# EAGLE design LightSwitch4 (EAGLE 9.2.1)
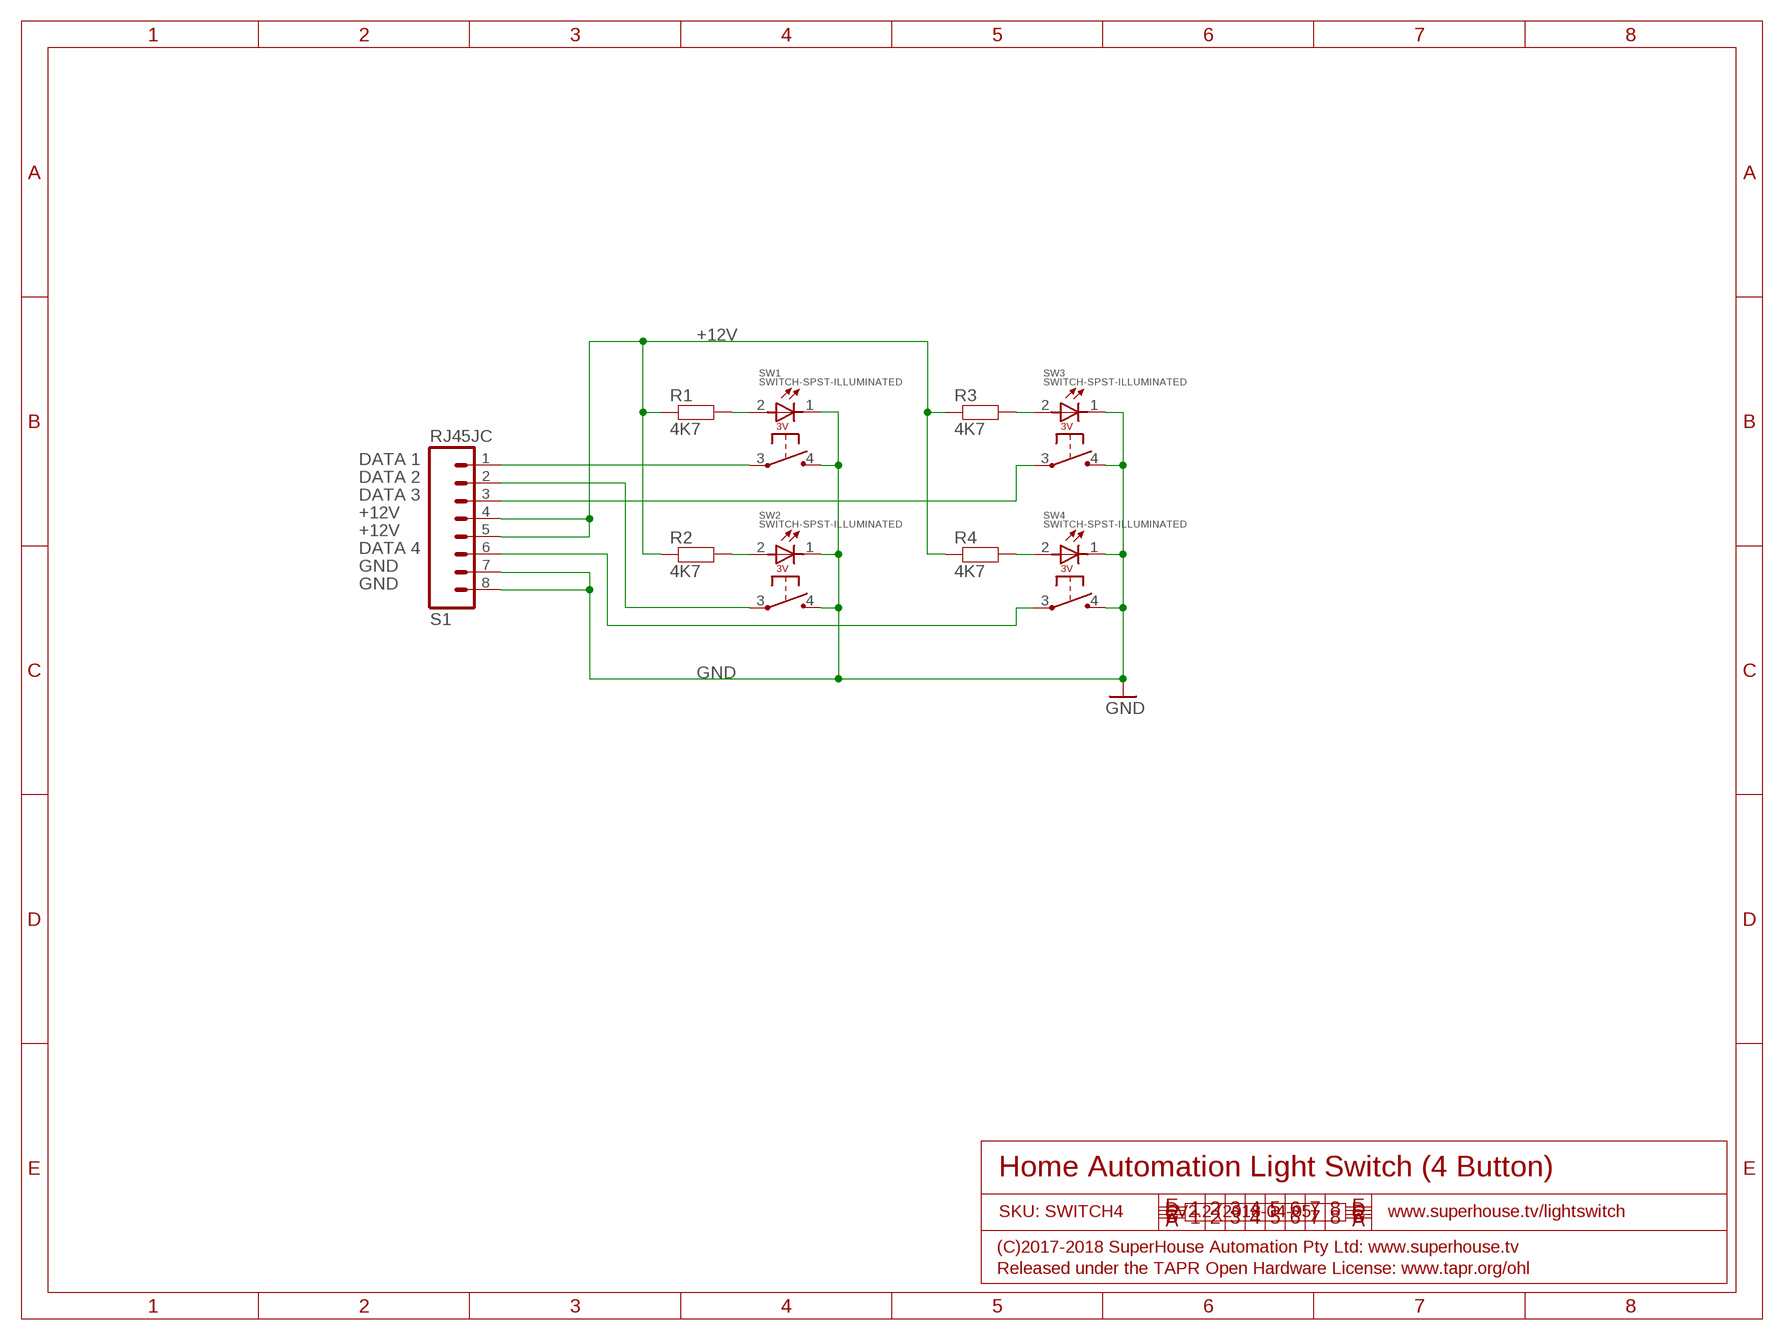
[diagram p0: schematic, sheet 1]

## Parts
R1  4K7  RESISTOR0603  [0603]
R2  4K7  RESISTOR0603  [0603]
R3  4K7  RESISTOR0603  [0603]
R4  4K7  RESISTOR0603  [0603]
S1  RJ45JC  [RJ45]
SW1  SWITCH-SPST-ILLUMINATED  [SWITCH-SPST-ILLUMINATED]
SW2  SWITCH-SPST-ILLUMINATED  [SWITCH-SPST-ILLUMINATED]
SW3  SWITCH-SPST-ILLUMINATED  [SWITCH-SPST-ILLUMINATED]
SW4  SWITCH-SPST-ILLUMINATED  [SWITCH-SPST-ILLUMINATED]

## Nets
+12V: R1.1 R2.1 R3.1 R4.1 S1.4 S1.5
GND: S1.7 S1.8 SW1.1(-) SW1.4(NO) SW2.1(-) SW2.4(NO) SW3.1(-) SW3.4(NO) SW4.1(-) SW4.4(NO)
N$1: R2.2 SW2.2(+)
N$2: S1.3 SW3.3(COM)
N$3: S1.6 SW4.3(COM)
N$4: S1.1 SW1.3(COM)
N$5: S1.2 SW2.3(COM)
N$6: R1.2 SW1.2(+)
N$7: R3.2 SW3.2(+)
N$8: R4.2 SW4.2(+)

## Notes on the sheet
- DATA 1
- DATA 2
- DATA 3
- +12V
- +12V
- DATA 4
- GND
- GND
- Home Automation Light Switch (4 Button)
- SKU: SWITCH4 | V2.2 (2018-04-05) | www.superhouse.tv/lightswitch
- (C)2017-2018 SuperHouse Automation Pty Ltd: www.superhouse.tv
- Released under the TAPR Open Hardware License: www.tapr.org/ohl

## Library data of the parts
R1-R4 = freetronics-jon:RESISTOR: Resistor Basic schematic elements and footprints for 0603, 1206, and PTH 1/10th watt (small) resistors.
S1 = freetronics-jon:RJ45
SW1-SW4 = freetronics-jon:SWITCH-SPST-ILLUMINATED

## Net classes
0 Default: width 0.203 mm
1 VCC: width 0.305 mm

## Board
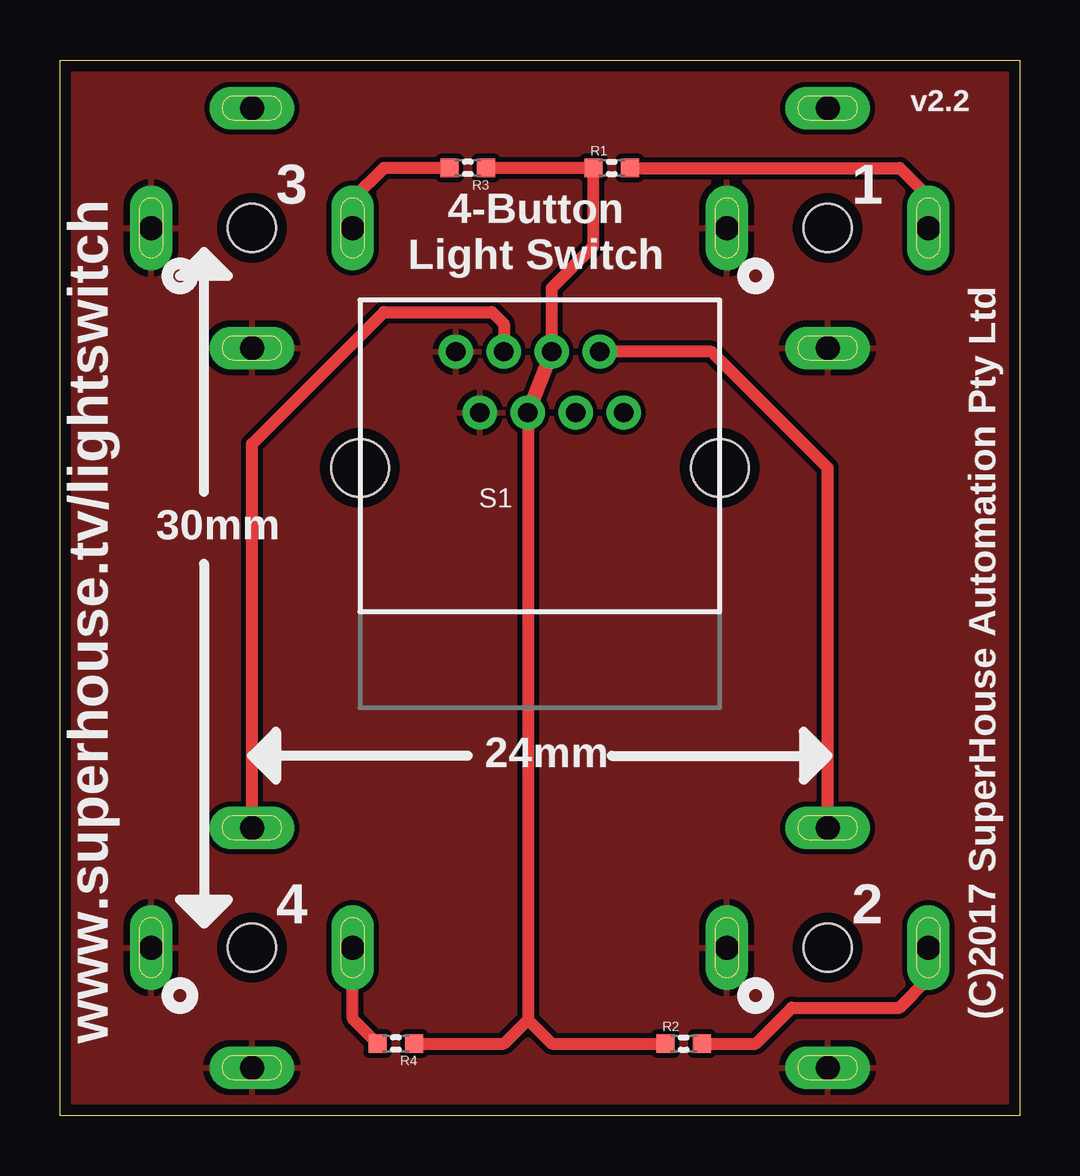
[diagram p1: board, top side]
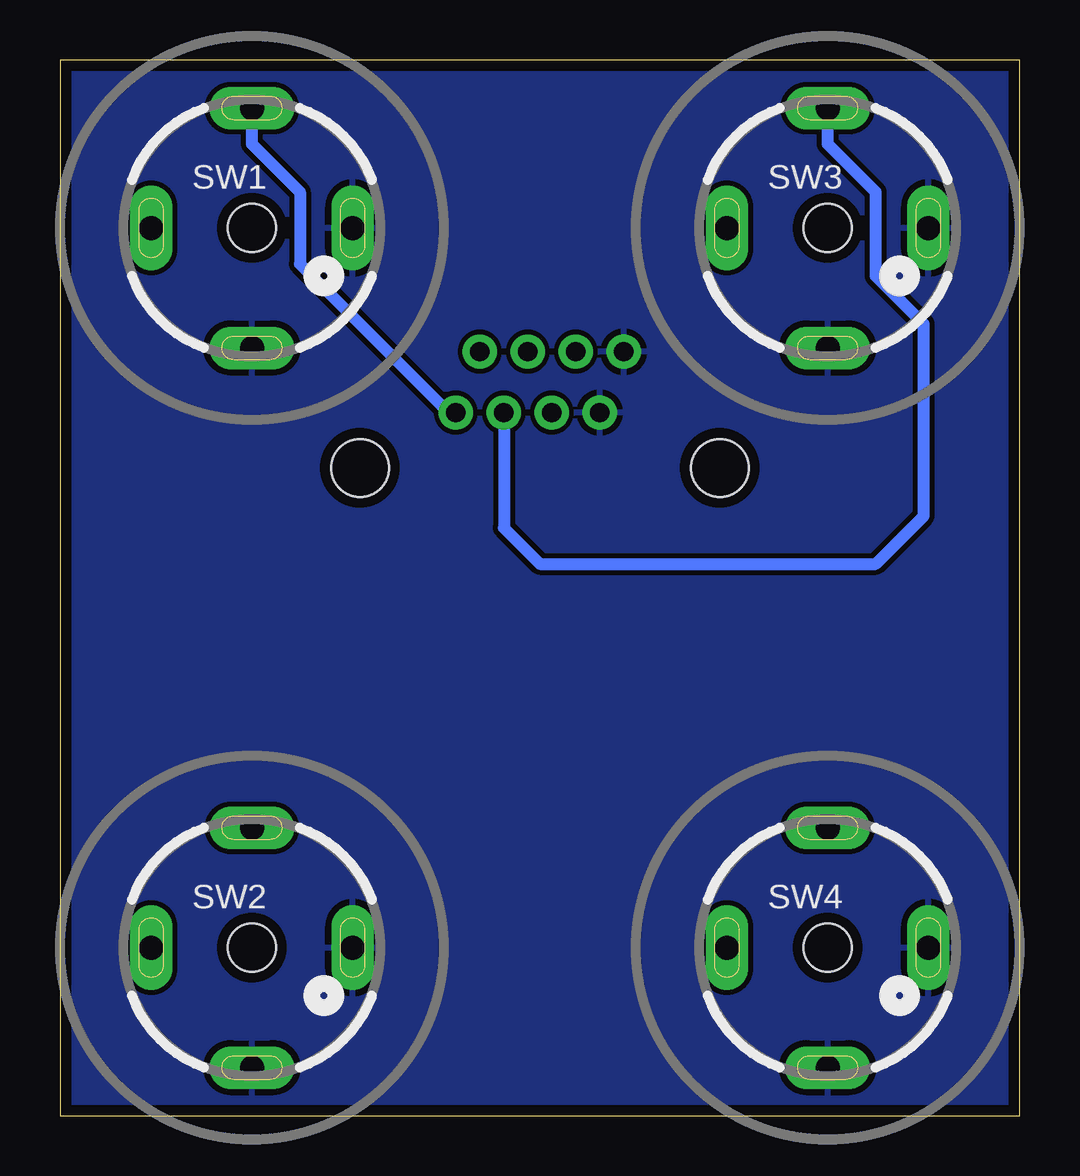
[diagram p2: board, bottom side, seen from below]

Size 40 x 44 mm. Coordinates in mm from the lower left corner, seen from the top.
Outline: 40,0 0,0 0,44 40,44 40,0
Copper layers (1*16): Top 0.035mm / dielectric 1.5mm / Bottom 0.035mm
Design rules "default *": minimum track width 8mil, minimum drill 15mil, track to track 8mil, track to pad 8mil, pad to pad 8mil, via to via 8mil, smd to smd 8mil, copper to edge 18mil, drill to drill 8mil, minimum pad ring 8mil, minimum via ring 6mil, stop-mask expansion 4mil, vias tented up to drill 25mil, thermal gap 10mil
Holes 2 mm at 8,7 32,7 32,37 8,37

### Footprints (pad centres in the part's own frame; a part is rotated, then mirrored left to right if it is on the bottom)
0603 = smd 0.762 x 0.762: 1 -0.762,0; 2 0.762,0
RJ45 = drill 0.8 pad 1.422: 1 3.5,2.3; 2 2.5,4.84; 3 1.5,2.3; 4 0.5,4.84; 5 -0.5,2.3; 6 -1.5,4.84; 7 -2.5,2.3; 8 -3.5,4.84 | hole 2.4: -7.5,0; 7.5,0
SWITCH-SPST-ILLUMINATED = drill 1 pad 1.778 long: 1 4.2,0; 2 -4.2,0; 3 0,5; 4 0,-5

### Placement (x,y rotation side)
R1  23,39.5 0 top
R2  26,3 0 top
R3  17,39.5 180 top
R4  14,3 180 top
S1  20,27 0 top
SW1  32,37 0 bottom
SW2  32,7 0 bottom
SW3  8,37 0 bottom
SW4  8,7 0 bottom

### Tracks (layer width: path | path; a pad name or v marks a point on that pad's centre or on a via)
+12V
  Top 0.508: R3.1 R1.1 22.24,36.24 20.5,34.5 S1.4 | 19.5,4 20.5,3 R2.1 | S1.5 19.5,4 | R4.1 18.5,3 19.5,4
  Top 0.61: S1.5 S1.4
GND
  pour Top: 40,44 0.04,44 0.04,0 40,0
  pour Bottom: 40,44 0.04,44 0.04,0 40,0
N$1
  Top 0.508: R2.2 29,3 30.5,4.5 35,4.5 36.2,5.7 SW2.2
N$2
  Bottom 0.508: S1.3 21.5,24.5 20,23 6,23 4,25 4,33 6,35 6,38.5 8,40.5 SW3.3
N$3
  Top 0.508: SW4.3 8,28 13.5,33.5 18,33.5 18.5,33 S1.6
N$4
  Bottom 0.508: SW1.3 32,40.5 30,38.5 30,35.5 23.8,29.3 S1.1
N$5
  Top 0.508: SW2.3 32,27 27.16,31.84 S1.2
N$6
  Top 0.508: SW1.2 36.2,38.3 35,39.5 R1.2
N$7
  Top 0.508: R3.2 13.5,39.5 12.2,38.2 SW3.2
N$8
  Top 0.508: R4.2 12.2,4.04 SW4.2

### Text on the board
tPlace: v2.2 | 3 | 1 | 4-Button / Light Switch | 30mm | 24mm | 4 | 2 | (C)2017 SuperHouse Automation Pty Ltd | www.superhouse.tv/lightswitch